# Altium schematic sheet ZLS-018.SchDoc
size Tabloid
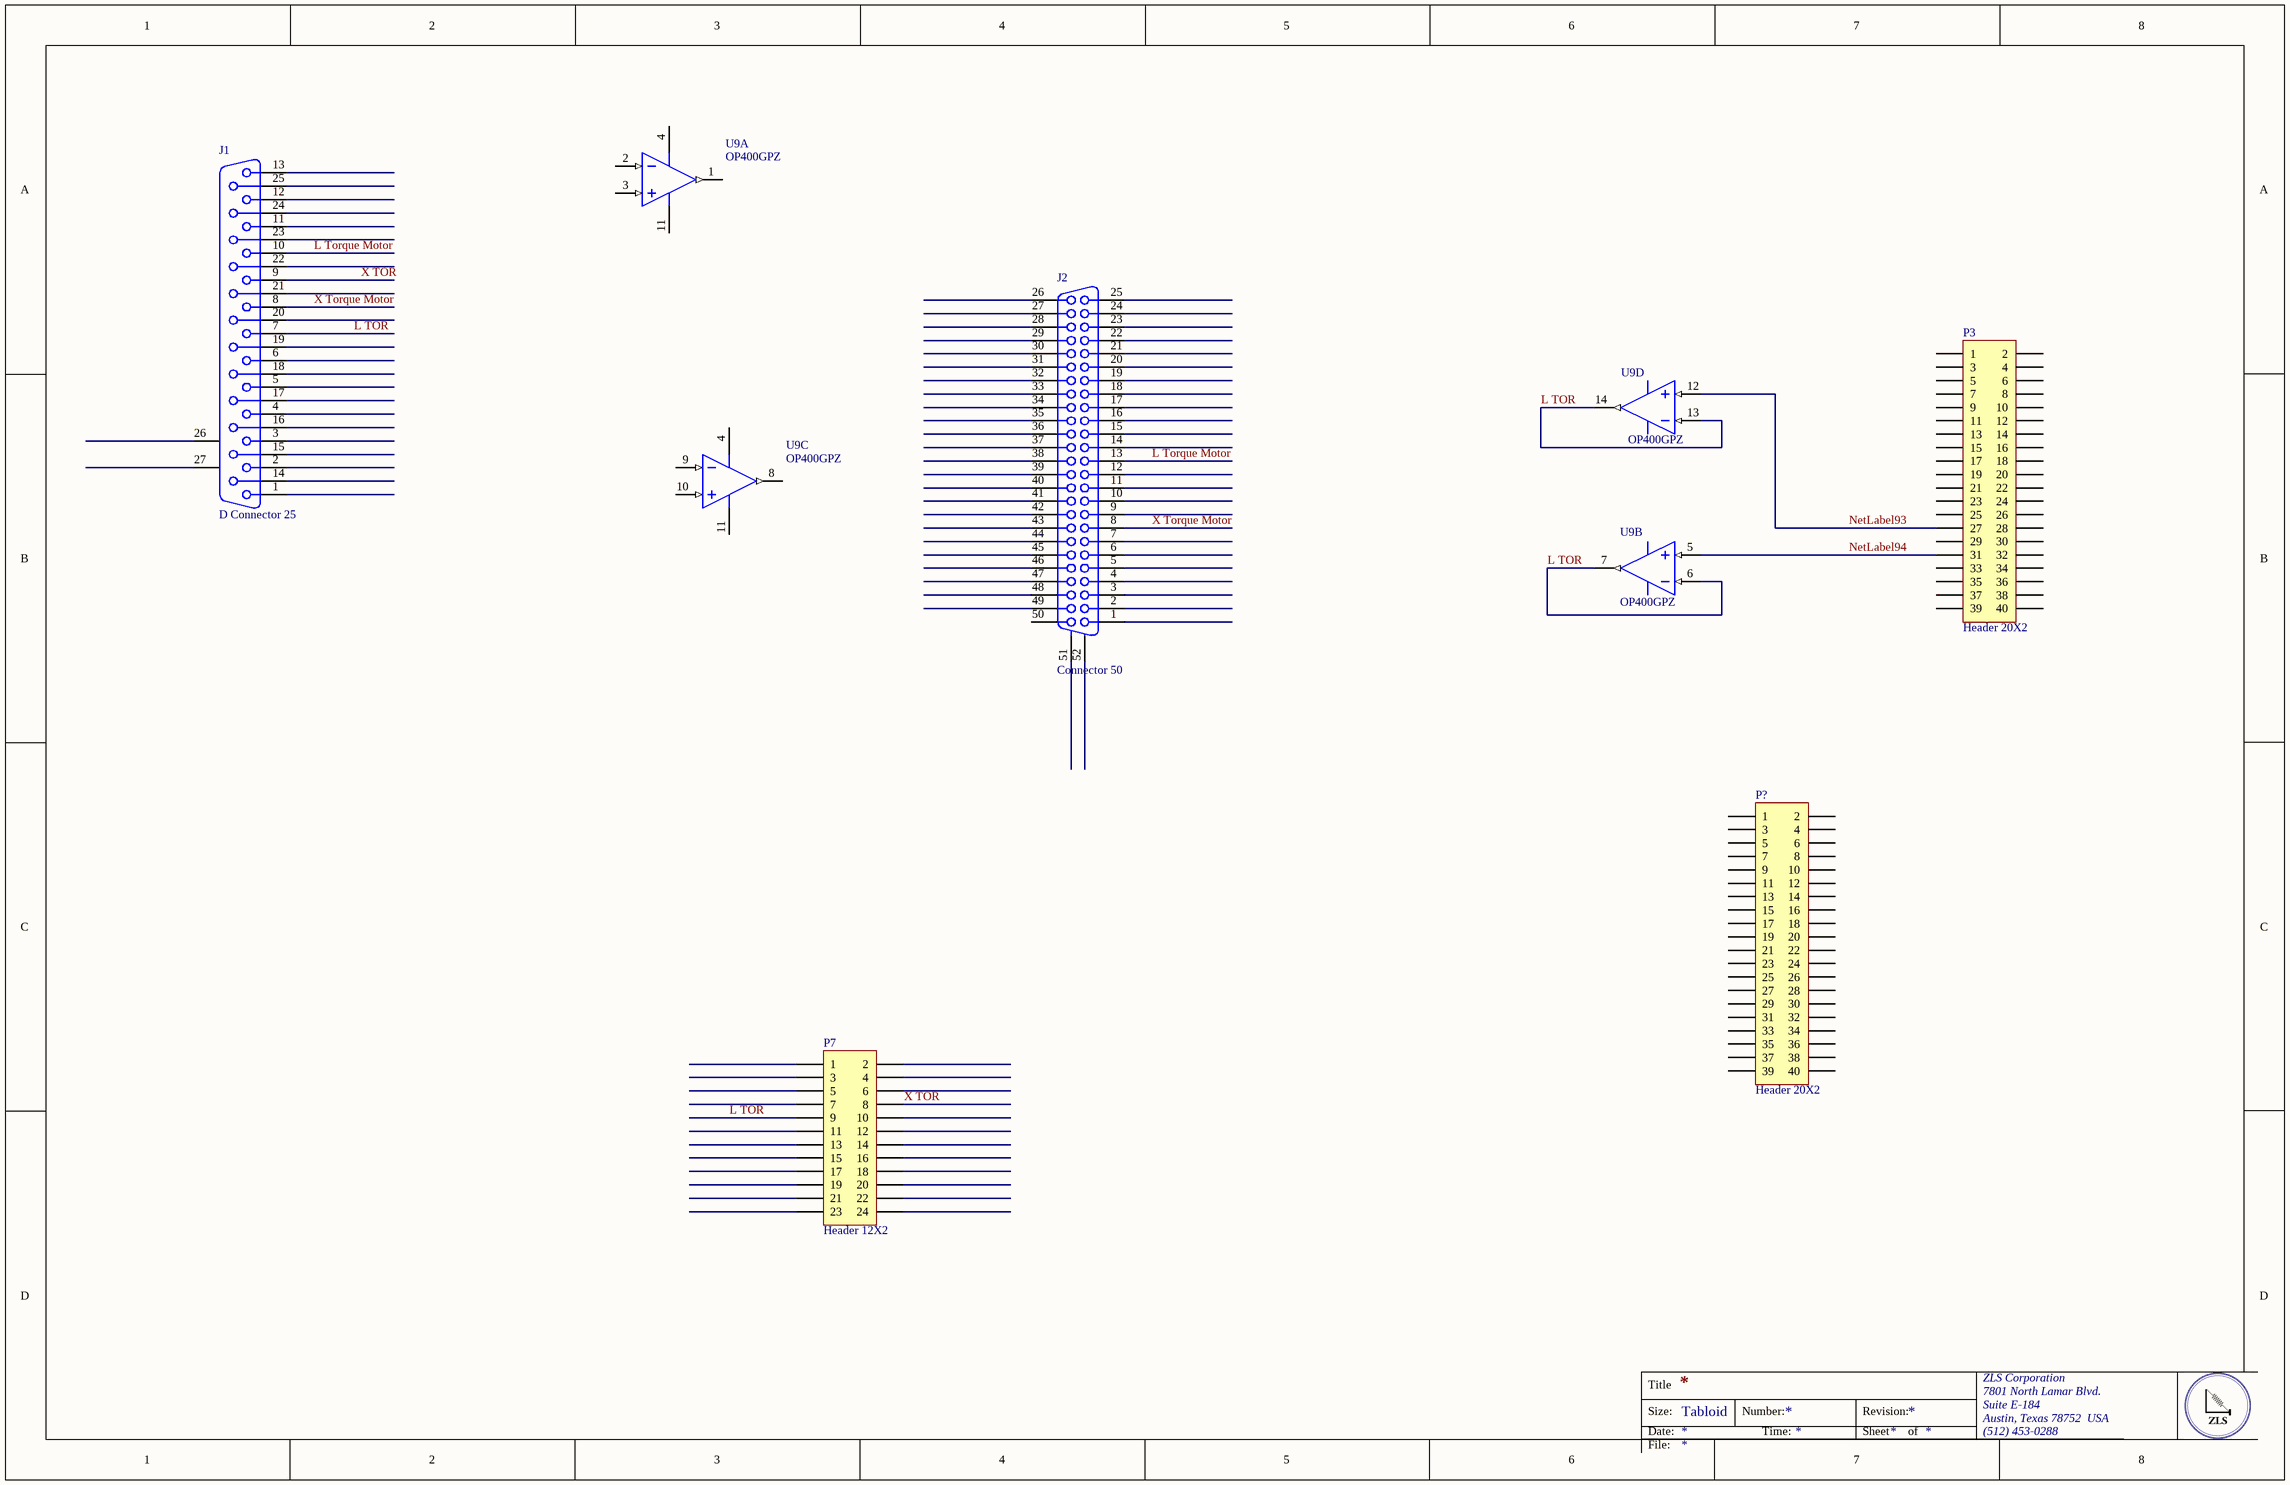
[diagram p0: ZLS-018.SchDoc]

## Parts
(Parts that share a designator on the sheet are numbered #1, #2 ... from top to bottom, then left to right.)
J1  D Connector 25  [DSUB1.385-2H25A]
J2  Connector 50  [CHAMP1.27-2H50]
P3  Header 20X2  [HDR2X20]
P7  Header 12X2  [HDR2X12]
P?  Header 20X2  [HDR2X20]
U9#1  OP400GPZ  [ADI-N-14]  (parts A,C of 4)
U9#2  OP400GPZ  [ADI-N-14]  (parts B,D of 4)

## Nets
L TOR: J1.7 P7.9 U9#2.6(-IN_B) U9#2.7(OUT_B) U9#2.13(-IN_D) U9#2.14(OUT_D)
L Torque Motor: J1.10 J2.13
NetLabel93: P3.27 U9#2.12(+IN_D)
NetLabel94: P3.31 U9#2.5(+IN_B)
X TOR: J1.9 P7.8
X Torque Motor: J1.8 J2.8

Not connected (* = marked no-connect by the designer): J1 1 2 3 4 5 6 11 12 13 14 15 16 17 18 19 20 21 22 23 24 25 26(MH1) 27(MH2); J2 1 2 3 4 5 6 7 9 10 11 12 14 15 16 17 18 19 20 21 22 23 24 25 26 27 28 29 30 31 32 33 34 35 36 37 38 39 40 41 42 43 44 45 46 47 48 49 50 51(MH1) 52(MH2); P3 1 2 3 4 5 6 7 8 9 10 11 12 13 14 15 16 17 18 19 20 21 22 23 24 25 26 28 29 30 32 33 34 35 36 37 38 39 40; P7 1 2 3 4 5 6 7 10 11 12 13 14 15 16 17 18 19 20 21 22 23 24; P? 1 2 3 4 5 6 7 8 9 10 11 12 13 14 15 16 17 18 19 20 21 22 23 24 25 26 27 28 29 30 31 32 33 34 35 36 37 38 39 40; U9#1 1(OUT_A) 2(-IN_A) 3(+IN_A) 4(+V) 8(OUT_C) 9(-IN_C) 10(+IN_C) 11(-V); U9#2 4(+V) 11(-V)

## Notes on the sheet
- Title
- Size:
- Date:
- Tabloid
- Number:
- Time:
- Revision:
- Sheet
- of
- ZLS Corporation
- 7801 North Lamar Blvd.
- Suite E-184
- Austin, Texas 78752  USA
- (512) 453-0288
- File:

## Library data of the parts
J1 = D Connector 25: Receptacle Assembly, 25 Position, Right Angle; PackageDocument: U; Positions: 25; Published: 15-Jun-2001; LatestRevisionDate: 17-Jul-2002; LatestRevisionNote: Re-released for DXP Platform.; DatasheetDocument: 19-Mar-1999; PackageReference: 787202; Publisher: Altium Limited; Orientation: Right Angle; Gender: Receptacle
J2 = Connector 50: Receptacle Header Assemby; PackageDocument: B; Positions: 50; Published: 15-Jun-2001; LatestRevisionDate: 17-Jul-2002; LatestRevisionNote: Re-released for DXP Platform.; DatasheetDocument: 1-Oct-1983; PackageReference: 178240-7; Publisher: Altium Limited; Orientation: Right Angle
P3 P? = Header 20X2: Header, 20-Pin, Dual row; LatestRevisionDate: 17-Jul-2002; LatestRevisionNote: Re-released for DXP Platform.; Publisher: Altium Limited
P7 = Header 12X2: Header, 12-Pin, Dual row; LatestRevisionDate: 17-Jul-2002; LatestRevisionNote: Re-released for DXP Platform.; Publisher: Altium Limited
U9#1 U9#2 = CMP-0384-00180-1: Quad Channel Low Supply Current Operational Amplifier, 500 KHz BW, 150 mV/us SR, Commercial, 14-pin DIP (N-14), Tube; Manufacturer: Analog Devices; Generic Part Number: OP400; Small Signal Bandwidth: 500KHz; V Span Max: 40V; Input Offset Voltage: 80uV; V Span Min: 6V; Input Bias Current: 750pA; Iq/Amp: 600uA; Amplifiers Per Package: 4; ComponentLink2URL: http://www.analog.com/static/imported-files/data_sheets/OP400.pdf; ComponentLink1URL: http://www.analog.com/en/index.html; PackageDescription: 14-Pin Plastic Dual In-Line Package, Row spacing 7.62 mm, Pitch 2.54 mm; PartNumber: OP400GPZ; DatasheetVersion: Rev. G; ComponentLink2Description: Datasheet; ComponentLink3Description: Package Specification; ComponentLink3URL: http://www.analog.com/static/imported-files/packages/N_14.pdf; PackageReference: N-14; Mounting Technology: Through Hole; PackageVersion: 070606-A; Code_JEDEC: MS-001; ComponentLink1Description: Manufacturer URL; Packing: Tube; Slew Rate: 150mV/us; PartId: 1